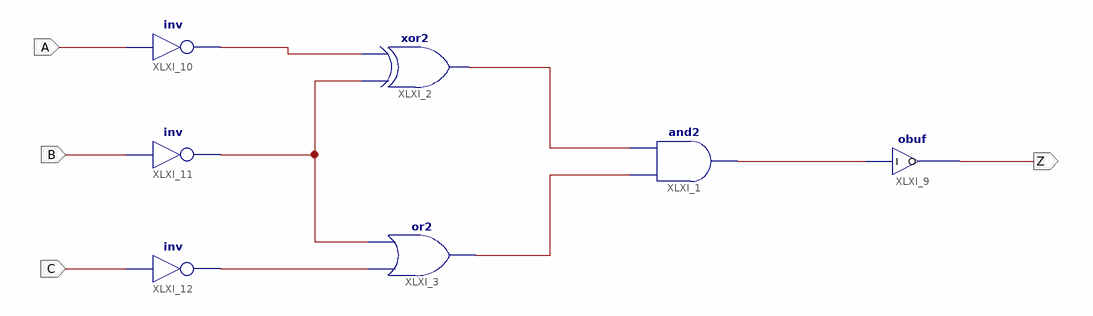
[diagram p0: schematic sheet 1]
// Xilinx ISE schematic Section2Schematic.sch (xc9500xl) as structural Verilog: 7 symbols, 4 ports
module Section2Schematic (
  input  A,
  input  B,
  input  C,
  output Z
);

  wire XLXN_1, XLXN_3, XLXN_5, XLXN_6, XLXN_7, XLXN_8;

  and XLXI_1 (XLXN_8, XLXN_7, XLXN_6);
  xor XLXI_2 (XLXN_6, XLXN_3, XLXN_1);
  or XLXI_3 (XLXN_7, XLXN_5, XLXN_3);
  obuf XLXI_9 (.I(XLXN_8), .O(Z));
  not XLXI_10 (XLXN_1, A);
  not XLXI_11 (XLXN_3, B);
  not XLXI_12 (XLXN_5, C);
endmodule
